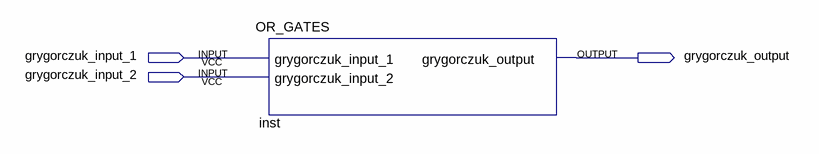
[diagram p0: schematic sheet]
// Quartus schematic OR_SYMBOL.bdf as structural Verilog: 1 symbols, 3 pins
module OR_SYMBOL (
  input  grygorczuk_input_1,
  input  grygorczuk_input_2,
  output grygorczuk_output
);

  OR_GATES inst (
    .grygorczuk_input_1(grygorczuk_input_1), .grygorczuk_input_2(grygorczuk_input_2),
    .grygorczuk_output(grygorczuk_output));
endmodule
